# EAGLE design pressure_and_flow_pcb (EAGLE 9.5.2)
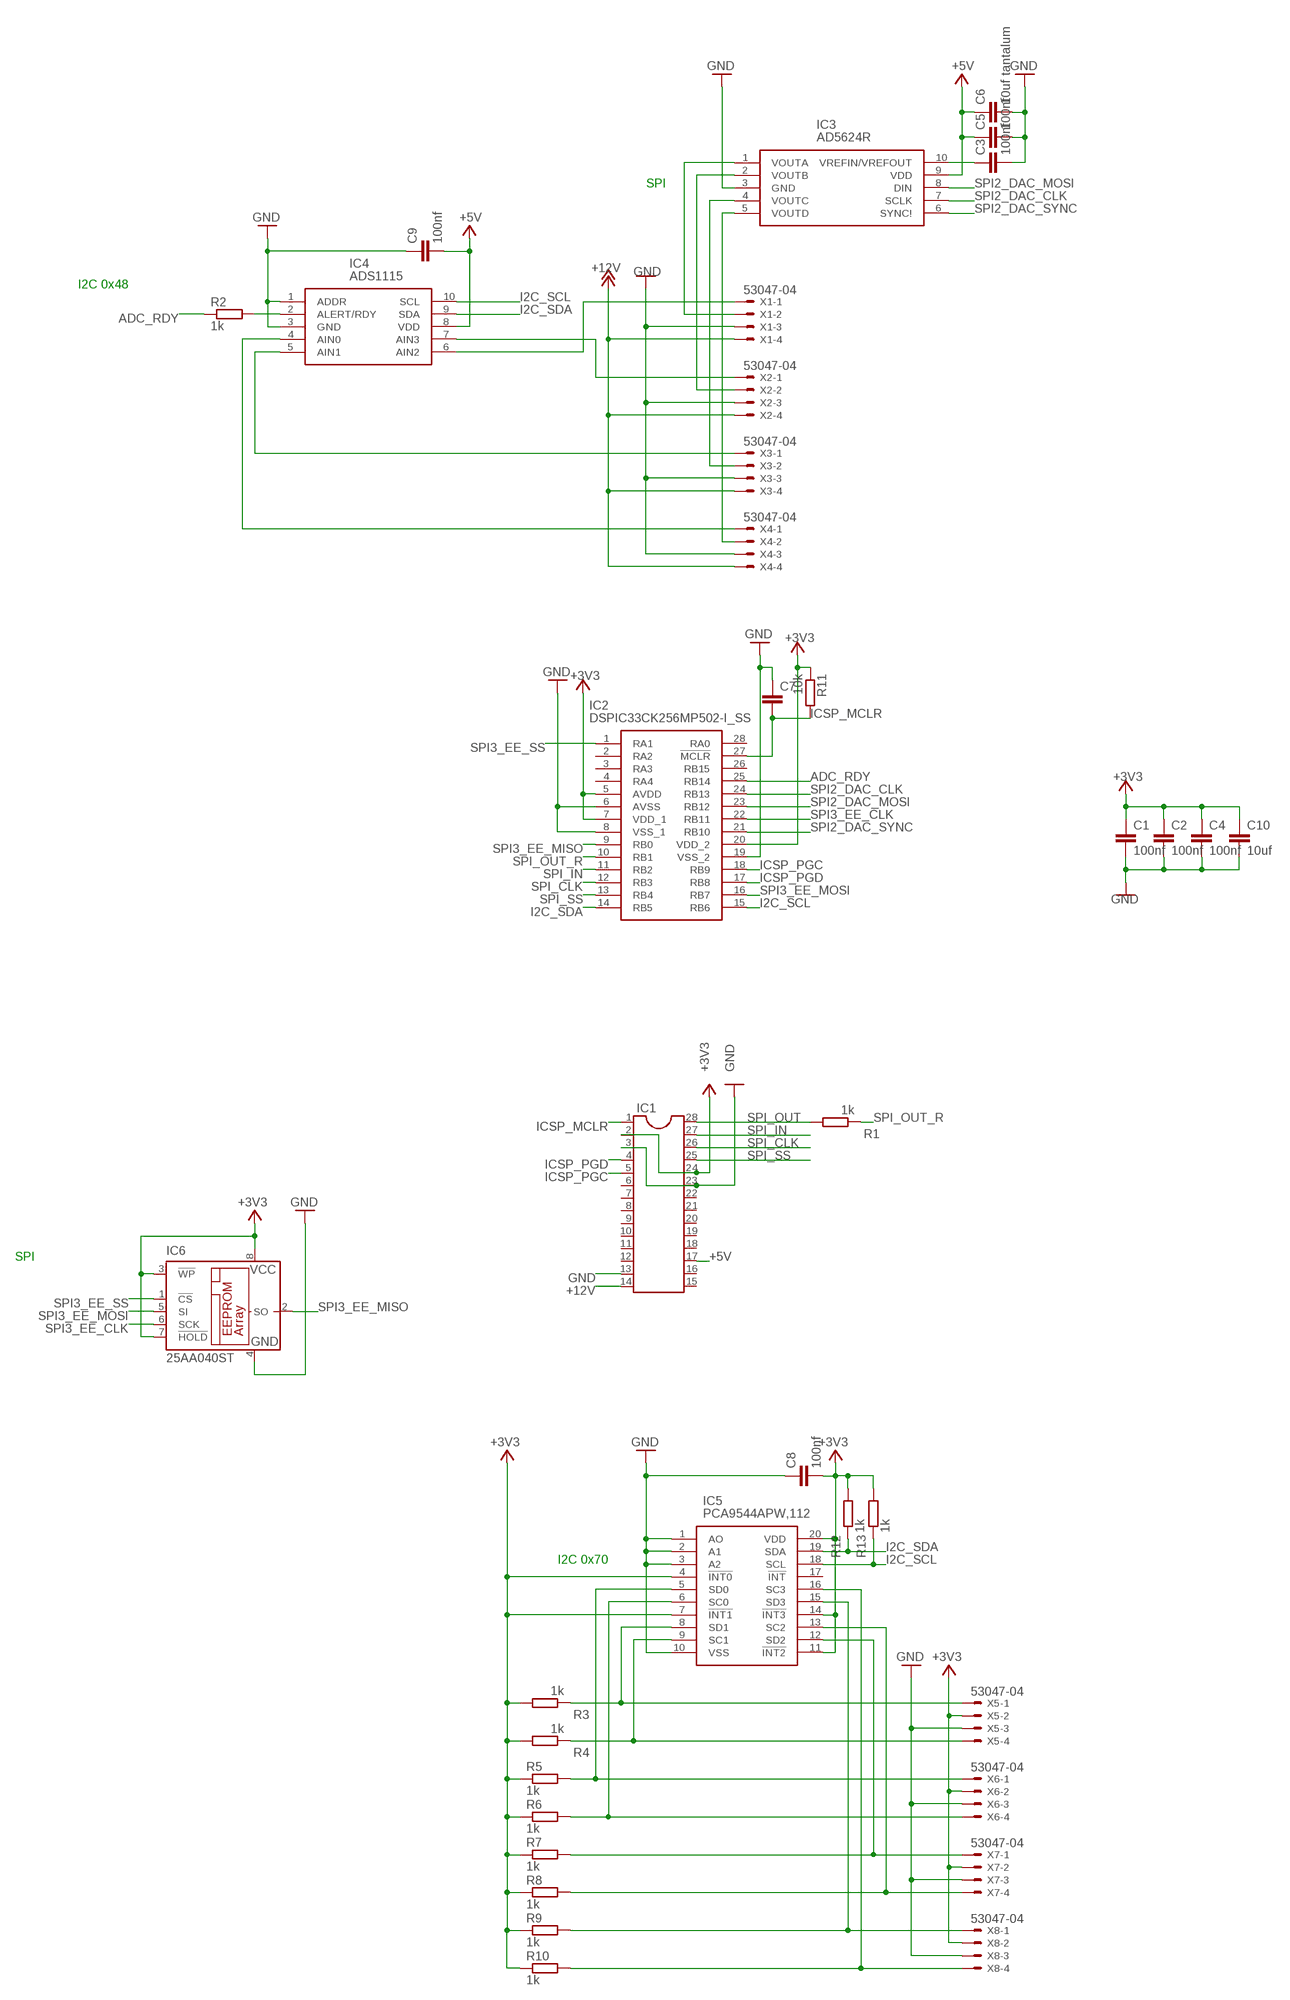
[diagram p0: schematic, sheet 1]

## Parts
C1  100nf  C-EUC0603K  [C0603K]
C2  100nf  C-EUC0603K  [C0603K]
C3  100nf  C-EUC0603K  [C0603K]
C4  100nf  C-EUC0603K  [C0603K]
C5  100nf  C-EUC0603K  [C0603K]
C6  10uf tantalum  C-EUC0603K  [C0603K]
C7  C-EUC0603K  [C0603K]
C8  100nf  C-EUC0603K  [C0603K]
C9  100nf  C-EUC0603K  [C0603K]
C10  10uf  C-EUC0603K  [C0603K]
IC1  DIL28  [DIL28-6]
IC2  DSPIC33CK256MP502-I_SS  [SOP65P780X200-28N]
IC3  AD5624R  AD5624RBRMZ-3  [SOP50P490X110-10N]
IC4  ADS1115  ADS1115BQDGSRQ1  [SOP50P490X110-10N]
IC5  PCA9544APW,112  [SOP65P640X110-20N]
IC6  25AA040ST  [TSSOP8]
R1  1k  R-EU_R0603  [R0603]
R2  1k  R-EU_R0603  [R0603]
R3  1k  R-EU_R0603  [R0603]
R4  1k  R-EU_R0603  [R0603]
R5  1k  R-EU_R0603  [R0603]
R6  1k  R-EU_R0603  [R0603]
R7  1k  R-EU_R0603  [R0603]
R8  1k  R-EU_R0603  [R0603]
R9  1k  R-EU_R0603  [R0603]
R10  1k  R-EU_R0603  [R0603]
R11  10k  R-EU_R0603  [R0603]
R12  1k  R-EU_R0603  [R0603]
R13  1k  R-EU_R0603  [R0603]
X1  53047-04  [53047-04]
X2  53047-04  [53047-04]
X3  53047-04  [53047-04]
X4  53047-04  [53047-04]
X5  53047-04  [53047-04]
X6  53047-04  [53047-04]
X7  53047-04  [53047-04]
X8  53047-04  [53047-04]

## Nets
+3V3: C1.1 C2.1 C4.1 C8.2 C10.1 IC1.2 IC1.24 IC2.5(AVDD) IC2.7(VDD_1) IC2.20(VDD_2) IC5.4(!INT0) IC5.7(!INT1) IC5.11(!INT2) IC5.14(!INT3) IC5.20(VDD) IC6.3(!WP) IC6.7(!HOLD) IC6.8(VCC) R3.2 R4.2 R5.1 R6.1 R7.1 R8.1 R9.1 R10.1 R11.1 R12.2 R13.2 X5.2 X6.2 X7.2 X8.2
+5V: C5.1 C6.1 C9.2 IC1.17 IC3.9(VDD) IC4.8(VDD)
+12V: IC1.14 X1.4 X2.4 X3.4 X4.4
ADC_RDY: IC2.25(RB14) R2.1
GND: C1.2 C2.2 C3.2 C4.2 C5.2 C6.2 C7.1 C8.1 C9.1 C10.2 IC1.3 IC1.13 IC1.23 IC2.6(AVSS) IC2.8(VSS_1) IC2.19(VSS_2) IC3.3(GND) IC4.1(ADDR) IC4.3(GND) IC5.1(AO) IC5.2(A1) IC5.3(A2) IC5.10(VSS) IC6.4(GND) X1.3 X2.3 X3.3 X4.3 X5.3 X6.3 X7.3 X8.3
I2C_CLK: IC5.9(SC1) R4.1 X5.4
I2C_DATA: IC5.8(SD1) R3.1 X5.1
I2C_SCL: IC2.15(RB6) IC4.10(SCL) IC5.18(SCL) R13.1
I2C_SDA: IC2.14(RB5) IC4.9(SDA) IC5.19(SDA) R12.1
ICSP_MCLR: C7.2 IC1.1 IC2.27(!MCLR) R11.2
ICSP_PGC: IC1.5 IC2.18(RB9)
ICSP_PGD: IC1.4 IC2.17(RB8)
N$1: C3.1 IC3.10(VREFIN/VREFOUT)
N$8: IC3.2(VOUTB) X2.2
N$9: IC3.4(VOUTC) X3.2
N$10: IC4.2(ALERT/RDY) R2.2
N$12: IC4.5(AIN1) X3.1
N$13: IC3.5(VOUTD) X4.2
N$14: IC5.5(SD0) R5.2 X6.1
N$15: IC5.6(SC0) R6.2 X6.4
N$18: IC5.12(SD2) R7.2 X7.1
N$19: IC5.13(SC2) R8.2 X7.4
N$20: IC5.15(SD3) R9.2 X8.1
N$21: IC5.16(SC3) R10.2 X8.4
N$22: IC4.7(AIN3) X2.1
N$25: IC4.4(AIN0) X4.1
PRESSURE_IN: IC4.6(AIN2) X1.1
PRESSURE_OUT: IC3.1(VOUTA) X1.2
SPI2_DAC_CLK: IC2.24(RB13) IC3.7(SCLK)
SPI2_DAC_MOSI: IC2.23(RB12) IC3.8(DIN)
SPI2_DAC_SYNC: IC2.21(RB10) IC3.6(SYNC!)
SPI3_EE_CLK: IC2.22(RB11) IC6.6(SCK)
SPI3_EE_MISO: IC2.9(RB0) IC6.2(SO)
SPI3_EE_MOSI: IC2.16(RB7) IC6.5(SI)
SPI3_EE_SS: IC2.1(RA1) IC6.1(!CS)
SPI_CLK: IC1.26 IC2.12(RB3)
SPI_IN: IC1.27 IC2.11(RB2)
SPI_OUT: IC1.28 R1.2
SPI_OUT_R: IC2.10(RB1) R1.1
SPI_SS: IC1.25 IC2.13(RB4)
Unconnected: IC1.6 IC1.7 IC1.8 IC1.9 IC1.10 IC1.11 IC1.12 IC1.15 IC1.16 IC1.18 IC1.19 IC1.20 IC1.21 IC1.22 IC2.2(RA2) IC2.3(RA3) IC2.4(RA4) IC2.26(RB15) IC2.28(RA0) IC5.17(!INT)

## Notes on the sheet
- SPI
- I2C 0x48
- SPI
- I2C 0x70

## Library data of the parts
C1-C10 = rcl:C-EU: CAPACITOR, European symbol; SPICEPREFIX: C
IC1 = ic-package:DIL28: Dual In Line
IC2 = dsPIC33CK256MP502-I_SS:DSPIC33CK256MP502-I_SS: Digital Signal Processors & Controllers - DSP, DSC 16 Bit DSC, 256KB Flash, 24KB RAM, 100MHz, 28Pin, 3 OpAmp, 3 Comp, PTG, CAN-FD Source: Datasheet <http://uk.rs-online.com/web/p/products/1793987P>; DESCRIPTION: Digital Signal Processors & Controllers - DSP, DSC 16 Bit DSC, 256KB Flash, 24KB RAM, 100MHz, 28Pin, 3 OpAmp, 3 Comp, PTG, CAN-FD; HEIGHT: 2mm; MANUFACTURER_NAME: Microchip; MANUFACTURER_PART_NUMBER: dsPIC33CK256MP502-I/SS; RS_PART_NUMBER: 1793987P; RS_PRICE-STOCK: http://uk.rs-online.com/web/p/products/1793987P
IC3 = AD5624RBRMZ-3:AD5624RBRMZ-3: Analog Devices AD5624RBRMZ-3, 4-channel 12 bit Serial DAC, 10-Pin MSOP Source: Datasheet <http://uk.rs-online.com/web/p/products/8065373P>; DESCRIPTION: Analog Devices AD5624RBRMZ-3, 4-channel 12 bit Serial DAC, 10-Pin MSOP; HEIGHT: mm; MANUFACTURER_NAME: Analog Devices; MANUFACTURER_PART_NUMBER: AD5624RBRMZ-3; RS_PART_NUMBER: 8065373P; RS_PRICE-STOCK: http://uk.rs-online.com/web/p/products/8065373P
IC4 = ADS1115BQDGSRQ1:ADS1115BQDGSRQ1: Automotive 16-Bit 860SPS 4-Ch Delta-Sigma ADC With PGA, Oscillator, VREF, Comparator, and I2C Source: Datasheet <http://www.ti.com/lit/gpn/ads1115-q1>; DESCRIPTION: Automotive 16-Bit 860SPS 4-Ch Delta-Sigma ADC With PGA, Oscillator, VREF, Comparator, and I2C; HEIGHT: 1.1mm; MANUFACTURER_NAME: Texas Instruments; MANUFACTURER_PART_NUMBER: ADS1115BQDGSRQ1
IC5 = PCA9544APW_112:PCA9544APW,112: NXP PCA9544APW,112, Multiplexer Single 4:1, 20-Pin TSSOP Source: Datasheet <http://www.nxp.com/docs/en/data-sheet/PCA9544A.pdf>; DESCRIPTION: NXP PCA9544APW,112, Multiplexer Single 4:1, 20-Pin TSSOP; HEIGHT: 1.1mm; MANUFACTURER_NAME: Nexperia; MANUFACTURER_PART_NUMBER: PCA9544APW,112; RS_PART_NUMBER: 7258852P; RS_PRICE-STOCK: http://uk.rs-online.com/web/p/products/7258852P
IC6 = microchip:25*: Serial EEPROM 4K/ 8K , SPI bus; MPN: 25AA040A-I/MS; OC_FARNELL: 1331345; OC_NEWARK: 35M0801
R1-R13 = rcl:R-EU_: RESISTOR, European symbol; SPICEPREFIX: R
X1-X8 = con-molex:53?-04: CONNECTOR wire to board 1.25 mm (.049 inch) pitch header; MF: WALDOM/MOLEX; MPN: 53047-0410; OC_FARNELL: 9733060; OC_NEWARK: 38C9900

## Board
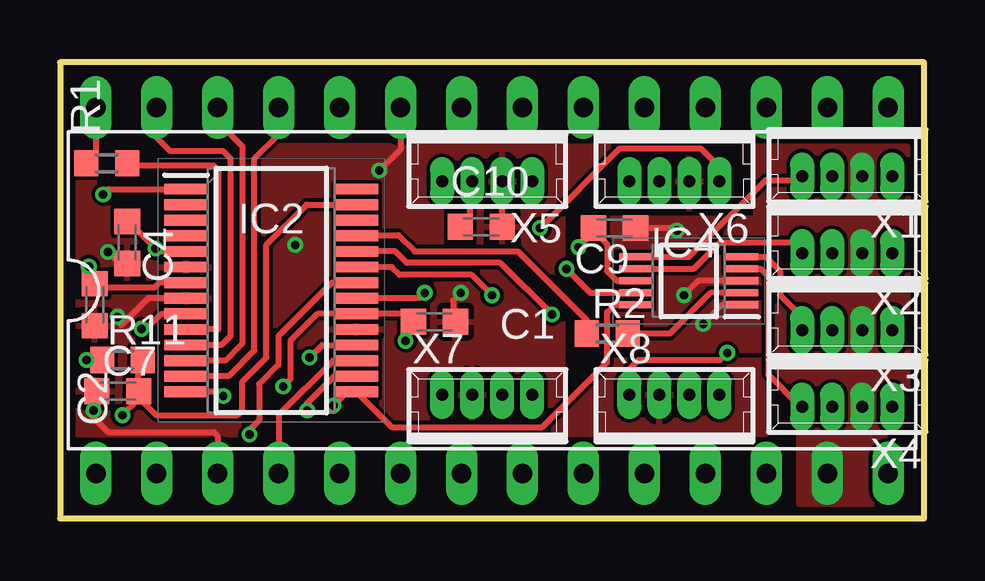
[diagram p1: board, top side]
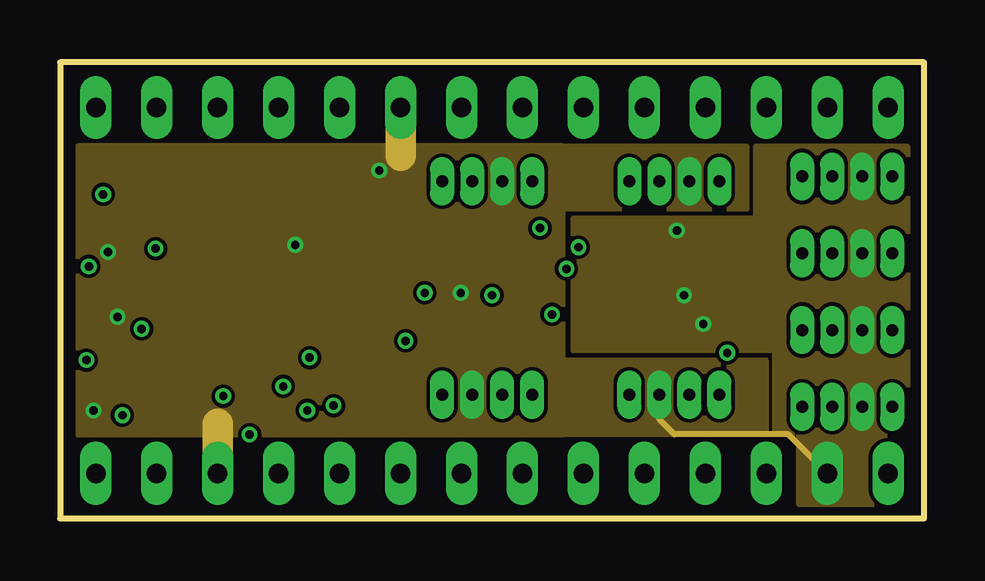
[diagram p2: board, inner layer GND]
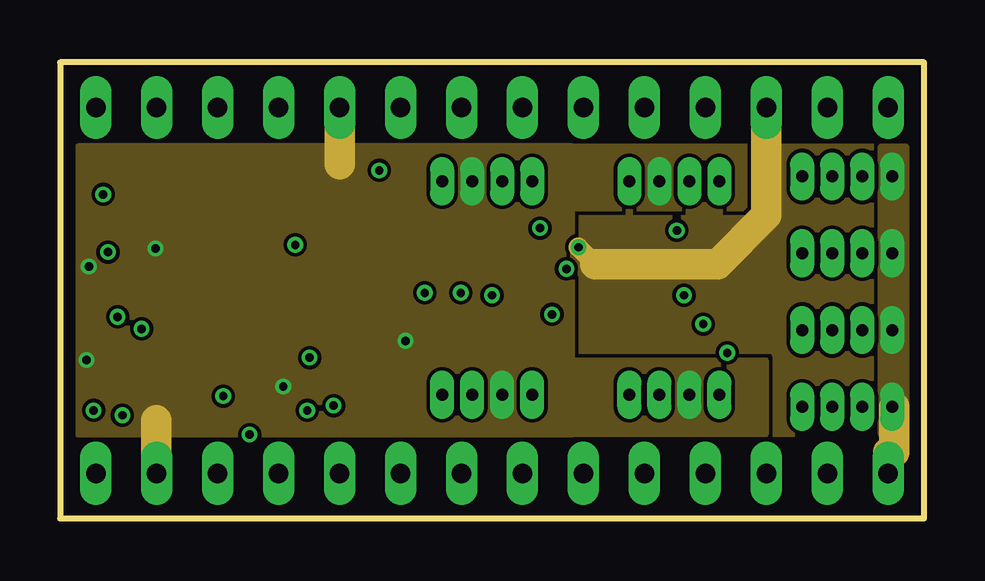
[diagram p3: board, inner layer POWER]
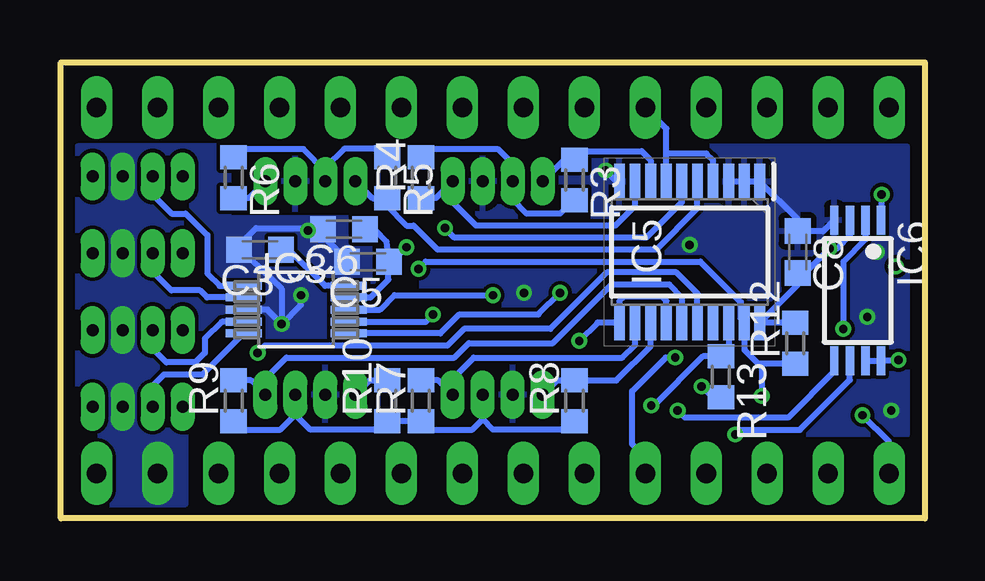
[diagram p4: board, bottom side, seen from below]

Size 36 x 19 mm. Coordinates in mm from the lower left corner, seen from the top.
Outline: 0,19 0,0 36,0 36,19 0,19
Copper layers (1+2*15+16): Top 0.035mm / dielectric 0.2mm / GND 0.035mm / dielectric 1mm / POWER 0.035mm / dielectric 0.2mm / Bottom 0.035mm
Design rules "ITEADstudio_DRC *": minimum track width 6mil, minimum drill 12mil, track to track 6mil, track to pad 6mil, pad to pad 6mil, via to via 6mil, smd to smd 0mil, copper to edge 10mil, drill to drill 10mil, minimum pad ring 10mil, minimum via ring 6mil, stop-mask expansion 2mil, vias tented up to drill 100mil, thermal gap 10mil

### Footprints (pad centres in the part's own frame; a part is rotated, then mirrored left to right if it is on the bottom)
C0603K = smd 1.05 x 1.08: 1 -0.875,0; 2 0.875,0
DIL28-6 = drill 0.813 long: 1 -16.51,-7.62; 2 -13.97,-7.62; 3 -11.43,-7.62; 4 -8.89,-7.62; 5 -6.35,-7.62; 6 -3.81,-7.62; 7 -1.27,-7.62; 8 1.27,-7.62; 9 3.81,-7.62; 10 6.35,-7.62; 11 8.89,-7.62; 12 11.43,-7.62; 13 13.97,-7.62; 14 16.51,-7.62; 15 16.51,7.62; 16 13.97,7.62; 17 11.43,7.62; 18 8.89,7.62; 19 6.35,7.62; 20 3.81,7.62; 21 1.27,7.62; 22 -1.27,7.62; 23 -3.81,7.62; 24 -6.35,7.62; 25 -8.89,7.62; 26 -11.43,7.62; 27 -13.97,7.62; 28 -16.51,7.62
SOP65P780X200-28N = smd 1.8 x 0.45: 1 -3.55,4.225; 2 -3.55,3.575; 3 -3.55,2.925; 4 -3.55,2.275; 5 -3.55,1.625; 6 -3.55,0.975; 7 -3.55,0.325; 8 -3.55,-0.325; 9 -3.55,-0.975; 10 -3.55,-1.625; 11 -3.55,-2.275; 12 -3.55,-2.925; 13 -3.55,-3.575; 14 -3.55,-4.225; 15 3.55,-4.225; 16 3.55,-3.575; 17 3.55,-2.925; 18 3.55,-2.275; 19 3.55,-1.625; 20 3.55,-0.975; 21 3.55,-0.325; 22 3.55,0.325; 23 3.55,0.975; 24 3.55,1.625; 25 3.55,2.275; 26 3.55,2.925; 27 3.55,3.575; 28 3.55,4.225
SOP50P490X110-10N = smd 1.499 x 0.33: 1 -2.184,0.991; 2 -2.184,0.508; 3 -2.184,0; 4 -2.184,-0.508; 5 -2.184,-0.991; 6 2.184,-0.991; 7 2.184,-0.508; 8 2.184,0; 9 2.184,0.508; 10 2.184,0.991
SOP50P490X110-10N' = smd 1.4 x 0.3: 1 -2.2,1; 2 -2.2,0.5; 3 -2.2,0; 4 -2.2,-0.5; 5 -2.2,-1; 6 2.2,-1; 7 2.2,-0.5; 8 2.2,0; 9 2.2,0.5; 10 2.2,1
SOP65P640X110-20N = smd 1.475 x 0.45: 1 -2.938,2.925; 2 -2.938,2.275; 3 -2.938,1.625; 4 -2.938,0.975; 5 -2.938,0.325; 6 -2.938,-0.325; 7 -2.938,-0.975; 8 -2.938,-1.625; 9 -2.938,-2.275; 10 -2.938,-2.925; 11 2.938,-2.925; 12 2.938,-2.275; 13 2.938,-1.625; 14 2.938,-0.975; 15 2.938,-0.325; 16 2.938,0.325; 17 2.938,0.975; 18 2.938,1.625; 19 2.938,2.275; 20 2.938,2.925
TSSOP8 = smd 0.35 x 1.2: 1 -0.975,-2.925; 2 -0.325,-2.925; 3 0.325,-2.925; 4 0.975,-2.925; 5 0.975,2.925; 6 0.325,2.925; 7 -0.325,2.925; 8 -0.975,2.925
R0603 = smd 1 x 1.1: 1 -0.85,0; 2 0.85,0
53047-04 = drill 0.5 pad 0.698 long: 1 1.875,0.45; 2 0.625,0.45; 3 -0.625,0.45; 4 -1.875,0.45

### Placement (x,y rotation side)
C1  15.6,8.2 0 top
C2  1.45,8.9 270 top
C3  27.7,11.2 180 bottom
C4  2.8,11.5 270 top
C5  23.2,10.7 180 bottom
C6  24.2,12.05 180 bottom
C7  2.4,5.3 0 top
C8  5.3,11.1 270 bottom
C9  23.1,12.1 180 top
C10  17.55,12.15 0 top
IC1  18,9.5 0 top
IC2  8.8,9.5 0 top
IC3  26.2,8.7 0 bottom
IC4  ADS1115  [SOP50P490X110-10N']  26.2,9.9 180 top
IC5  9.8,11.1 270 bottom
IC6  2.8,9.5 180 bottom
R1  1.95,14.8 180 top
R2  22.8,7.7 0 top
R3  14.6,14.1 270 bottom
R4  21,14.2 90 bottom
R5  22.4,14.2 270 bottom
R6  28.8,14.2 270 bottom
R7  21,4.9 90 bottom
R8  14.6,4.9 90 bottom
R9  28.8,4.9 90 bottom
R10  22.4,4.9 90 bottom
R11  2.6,6.6 0 top
R12  5.4,7.3 90 bottom
R13  8.5,5.9 270 bottom
X1  32.8,14.7 180 top
X2  32.8,11.5 180 top
X3  32.8,8.3 180 top
X4  32.8,5.1 180 top
X5  17.8,14.5 180 top
X6  25.6,14.5 180 top
X7  17.8,4.7 0 top
X8  25.6,4.7 0 top

### Tracks (layer width: path | path; a pad name or v marks a point on that pad's centre or on a via)
+3V3  (via drill 0.35)
  Top 0.254: IC2.7 4.12,9.82 3.92,9.62 1.58,9.62 1.45,9.75 C2.1 1.45,10.25 v1.2,10.5 | IC2.5 4.17,11.12 4.06,11.24 v3.98,11.24 2.95,12.27 2.95,12.35 2.92,12.38 C4.1 | R11.1 v1.1,6.6 | v9.3,5.5 9.6,5.8 9.6,7.4 10.72,8.53 IC2.20 14.43,8.53 14.43,8.5 C1.1 | X5.2 17.07,13.95 17.07,12.55 C10.1
  POWER 1.27: IC1.2 4,1.91 4,4.1 | IC1.24 11.65,14.75
  Bottom 0.254: IC6.7 IC6.8 1.12,6.58 v1.1,6.6 | IC6.3 3.12,11.78 3.66,11.24 v3.98,11.24 4.99,10.23 C8.2 5.3,9.74 IC5.20 5.41,8.16 R12.2 | R3.2 14.65,13.25 15.2,12.7 16.6,12.7 17.18,13.28 X5.2 17.18,14.78 17.8,15.4 20.65,15.4 R4.2 | R5.1 22.75,15.4 24.2,15.4 24.98,14.62 24.98,14.47 | R6.1 28.45,15.4 25.9,15.4 24.98,14.47 | 24.98,14.47 X6.2 | R8.1 14.95,3.7 18,3.7 18.43,4.12 | 18.43,4.12 X7.2 | 18.43,4.12 18.85,3.7 20.65,3.7 R7.1 R10.1 22.75,3.7 25.6,3.7 26.23,4.33 | 26.23,4.33 X8.2 | R9.1 28.45,3.7 26.85,3.7 26.23,4.33 | R13.2 8.85,5.05 v9.3,5.5 | IC5.7 10.78,15.2 | 10.78,15.2 10.78,16.25 IC1.24 | IC5.4 8.82,14.93 9.1,15.2 10.78,15.2 | IC5.14 10.78,9.07 10.95,9.24 12.55,9.24 12.72,9.07 IC5.11 13.64,8.16 v14.4,7.4
  pour POWER (no thermals): 0.75,15.5 0.75,3.5 21.35,3.5 21.35,15.5
  pour POWER (no thermals): 21.1,15.5 28.7,15.5 28.7,12.9 21.1,12.9
  pour POWER (no thermals): 21.1,6.6 29.4,6.6 29.4,3.5 21.1,3.5
+5V  (via drill 0.35)
  Top 0.254: IC4.8 23.2,9.9 22.8,10.3 22.8,11.41 C9.2 22.23,11.93 v21.6,11.3
  POWER 0.813: 22.3,10.6 v21.6,11.3
  POWER 1.27: IC1.17 29.43,12.63 27.4,10.6 22.3,10.6
  Bottom 0.254: IC3.9 23.09,9.21 22.35,9.95 C5.1 | C5.1 22.43,11.53 22.93,12.05 C6.1 | C5.1 22.2,10.7 v21.6,11.3
  pour POWER (rank 2, no thermals): 21,15.5 34.2,15.5 34.2,3.5 21,3.5
+12V
  POWER 1.27: IC1.14 34.51,2.75 34.77,2.75 34.77,4.65
  pour POWER (no thermals): 35.25,15.5 35.25,3.5 34.2,3.5 34.2,15.5
ADC_RDY
  Top 0.254: R2.1 21.95,8.25 19.07,11.12 14.78,11.12 14.1,11.8 12.38,11.8 IC2.25
GND  (via drill 0.35)
  Top 0.254: IC2.8 3.67,9.18 2.55,8.05 2.55,8.25 v2.4,8.4 | C7.1 1.55,4.65 v1.4,4.5 1.4,4.2 2,3.6 6.4,3.6 6.57,3.43 IC1.3 | IC4.3 26.6,9.9 v26,9.3 | IC4.1 27.6,8.9 v26.8,8.1 | v25.7,12 25.6,12.1 C9.1 | C4.2 2.45,10.65 v2,11.1 | v16.7,9.4 16.38,9.07 16.38,8.3 C1.2 | C10.2 X5.3 | IC1.23 14.19,15.39 v13.3,14.5
  GND 0.254: IC1.13 30.35,3.5 25.6,3.5 24.98,4.12 X8.3
  GND 1.27: IC1.3 6.57,3.96 | IC1.23 14.19,15.11
  Bottom 0.254: IC5.3 IC5.2 IC5.1 5.3,12.46 C8.1 4.24,11.96 IC6.4 | v13.3,14.5 12.84,14.04 IC5.10 | IC3.3 27.4,8.7 v26.8,8.1 | v26.8,8.1 26,8.9 v26,9.3 | 24.15,10.85 25.07,11.75 C6.2 25.11,12 v25.7,12 | v25.7,12 25.75,12 | v25.7,12 25.8,12.1 27.86,12.1 28.57,11.4 C3.2 28.5,11.2 26.8,9.56 v26.8,8.1
  other vias: 9.8,11.4
  pour Top: 0.75,15.5 0.75,3.5 20.95,3.5 20.95,15.5
  pour Bottom: 0.75,15.5 0.75,3.5 20.95,3.5 20.95,15.5
  pour GND (no thermals): 0.75,15.5 0.75,3.5 20.95,3.5 20.95,15.5
  pour GND (no thermals): 20.6,15.5 28.6,15.5 28.6,12.9 20.6,12.9
  pour GND (no thermals): 20.6,6.6 29.4,6.6 29.4,3.5 20.6,3.5
  pour GND (no thermals): 21.4,12.5 29,12.5 29,15.5 35.3,15.5 35.3,0.6 30.8,0.6 30.8,3.5 29.8,3.5 29.8,7 21.4,7
  pour Top: 17.9,15.5 28.6,15.5 28.6,12.9 17.9,12.9
  pour Top: 20.6,6.6 29.4,6.6 29.4,3.5 20.6,3.5
  pour Top (no thermals): 21.4,12.5 29,12.5 29,15.5 35.3,15.5 35.3,0.6 30.8,0.6 30.8,3.5 29.8,3.5 29.8,7 21.4,7
  pour Bottom: 20.6,15.5 28.6,15.5 28.6,12.9 20.6,12.9
  pour Bottom: 20.6,6.6 29.4,6.6 29.4,3.5 20.6,3.5
  pour Bottom (no thermals): 21.4,12.5 29,12.5 29,15.5 35.3,15.5 35.3,0.6 30.8,0.6 30.8,3.5 29.8,3.5 29.8,7 21.4,7
I2C_CLK
  Bottom 0.254: IC5.9 12.07,13.03 12.9,12.2 18.7,12.2 19.68,13.18 X5.4 20.38,13.35 R4.1
I2C_DATA
  Bottom 0.254: X5.1 15.02,14.95 R3.1 14.25,15.3 11.8,15.3 11.43,14.93 IC5.8
I2C_SCL  (via drill 0.35)
  Top 0.254: v11.4,4.7 11.97,5.28 IC2.15 13.82,3.8 20.1,3.8 22.8,6.5 22.8,8.6 23.1,8.9 IC4.10
  Bottom 0.254: IC5.18 8.18,7.08 R13.1 9.25,6.75 11.3,4.7 v11.4,4.7
I2C_SDA  (via drill 0.35)
  Top 0.254: v6.8,5.1 6.62,5.28 IC2.14 | v21.1,10.4 22.1,9.4 IC4.9
  Bottom 0.254: 6.95,6.45 7.53,7.03 IC5.19 7.67,8.31 7.67,9.02 9.36,10.7 20.8,10.7 v21.1,10.4 | 6.95,6.45 6.8,6.3 v6.8,5.1 | R12.1 6.95,6.45
ICSP_MCLR  (via drill 0.35)
  Top 0.254: IC2.27 10.28,13.07 8.6,11.4 8.6,6.7 7.6,5.7 7.6,4.5 7.4,4.3 4,4.3 3.25,5.05 C7.2 | C7.2 3.25,4.95 v2.6,4.3 | C7.2 3.25,6.4 R11.2
  Bottom 0.254: IC1.1 1.49,3.19 v2.6,4.3
ICSP_PGC  (via drill 0.35)
  Top 0.254: v10.4,6.7 10.93,7.22 IC2.18
  Bottom 0.254: IC1.5 11.65,2.55 12.2,3.1 12.2,5.3 10.8,6.7 v10.4,6.7
ICSP_PGD
  Top 0.254: IC1.4 9.11,4.31 11.38,6.58 IC2.17
N$1
  Bottom 0.254: IC3.10 24.99,9.69 26.61,11.31 C3.1
N$8
  Bottom 0.254: IC3.2 29.91,9.21 30.2,9.5 31.4,9.5 32.17,10.28 X2.2
N$9
  Bottom 0.254: IC3.4 29.31,8.19 30,7.5 30,6.9 30.4,6.5 31.6,6.5 32.17,7.08 X3.2
N$10
  Top 0.254: IC4.2 27.1,9.4 25.4,7.7 R2.2
N$12
  Top 0.254: IC4.5 29.4,10.9 30.01,10.29 30.01,9.3 30.93,8.38 X3.1
N$13
  Bottom 0.254: IC3.5 30.1,5.99 31.71,5.99 32.17,5.53 X4.2
N$14
  Bottom 0.254: IC5.5 9.47,12.93 11.2,11.2 20.3,11.2 21.3,12.2 21.6,12.2 22.4,13 R5.2 23.02,13.35 X6.1
N$15  (via drill 0.35)
  Top 0.254: X6.4 27.48,14.65 26.73,15.4 23.3,15.4 v20,12.1
  Bottom 0.254: IC5.6 10.12,13.18 11.6,11.7 19.6,11.7 v20,12.1 | X6.4 28.18,13.35 R6.2
N$18
  Bottom 0.254: R7.2 20.27,5.75 X7.1 19.68,5.83 18.8,6.7 12.6,6.7 12.07,7.22 IC5.12
N$19
  Bottom 0.254: X7.4 15.32,5.75 R8.2 12.85,5.75 11.43,7.17 IC5.13
N$20
  Bottom 0.254: R9.2 28.07,5.75 X8.1 27.48,5.83 26.6,6.7 19.6,6.7 19,7.3 15.5,7.3 13.05,9.75 10.65,9.75 10.12,9.22 IC5.15
N$21  (via drill 0.35)
  Top 0.254: v27.8,6.9 27.5,6.6 24.1,6.6 23.73,6.22 X8.4
  Bottom 0.254: X8.4 23.12,5.75 R10.2 | IC5.16 9.47,9.38 10.35,10.25 13.25,10.25 15.6,7.9 19.2,7.9 19.9,7.2 27.5,7.2 v27.8,6.9
N$22
  Top 0.254: IC4.7 26.4,10.4 27.5,11.5 28.2,11.5 30.48,11.5 X2.1
N$25
  Top 0.254: IC4.4 29.2,10.4 29.5,10.1 29.5,6 30.85,4.65 X4.1
PRESSURE_IN
  Top 0.254: IC4.6 26.2,10.9 29.4,14.1 30.77,14.1 X1.1
PRESSURE_OUT
  Bottom 0.254: X1.2 32.11,14.18 32.11,13.42 31.39,12.7 30.8,12.7 29.9,11.8 29.9,10.2 29.39,9.69 IC3.1
SPI2_DAC_CLK  (via drill 0.35)
  Top 0.254: v20.5,8.5 18.35,10.65 14.45,10.65 13.97,11.12 IC2.24
  Bottom 0.254: IC3.7 20.81,8.19 v20.5,8.5
SPI2_DAC_MOSI  (via drill 0.35)
  Top 0.254: v18,9.3 17.15,10.15 14.15,10.15 13.82,10.47 IC2.23
  Bottom 0.254: IC3.8 22.7,8.7 22.1,9.3 v18,9.3
SPI2_DAC_SYNC  (via drill 0.35)
  Top 0.254: v15.2,9.4 14.97,9.18 IC2.21
  Bottom 0.254: v15.2,9.4 16.1,8.5 19.4,8.5 20.19,7.71 IC3.6
SPI3_EE_CLK  (via drill 0.35)
  Top 0.254: IC2.22 11.32,9.82 9.1,7.6 9.1,6.4 8.3,5.6 8.3,4.1 7.9,3.7 v7.9,3.49
  Bottom 0.254: v7.9,3.49 7.7,3.69 5.21,3.69 3.12,5.78 IC6.6
SPI3_EE_MISO  (via drill 0.35)
  Top 0.254: v3.4,7.9 3.6,7.9 4.22,8.53 IC2.9
  Bottom 0.254: IC6.2 2.48,11.62 3.4,10.7 3.4,9.9 v3.4,7.9
SPI3_EE_MOSI  (via drill 0.35)
  Top 0.254: v10.3,4.5 10.3,4.8 11.43,5.92 IC2.16
  Bottom 0.254: IC6.5 3.78,6.12 5.7,4.2 10,4.2 v10.3,4.5
SPI3_EE_SS  (via drill 0.35)
  Top 0.254: v1.8,13.5 2.02,13.72 IC2.1
  Bottom 0.254: v1.8,13.5 1.83,13.47 IC6.1
SPI_CLK
  Top 0.254: IC1.26 6.57,16.53 7.6,15.5 7.6,7.3 6.88,6.58 IC2.12
SPI_IN
  Top 0.254: IC1.27 4.03,15.87 4.6,15.3 6.8,15.3 7.1,15 7.1,7.6 6.72,7.22 IC2.11
SPI_OUT
  Top 0.254: IC1.28 1.49,15.19 R1.2
SPI_OUT_R
  Top 0.254: R1.1 2.9,14.7 6.4,14.7 6.6,14.5 6.6,7.9 6.58,7.88 IC2.10
SPI_SS
  Top 0.254: IC1.25 9.11,16.01 8.1,15 8.1,7 7.03,5.92 IC2.13

### Text on the board
Document: MISO | MOSI | CLK | SS | 3V3 | GND | 5V | MCLR | 3V3 | GND | ICSP PGD | ICSP PGC | 12V GND | 12V
Connectors_doc: Pressure 1 | Flow 1 | Flow 2 | Pressure 2 | Pressure 3 | Flow 3 | Flow 4 | Pressure 4